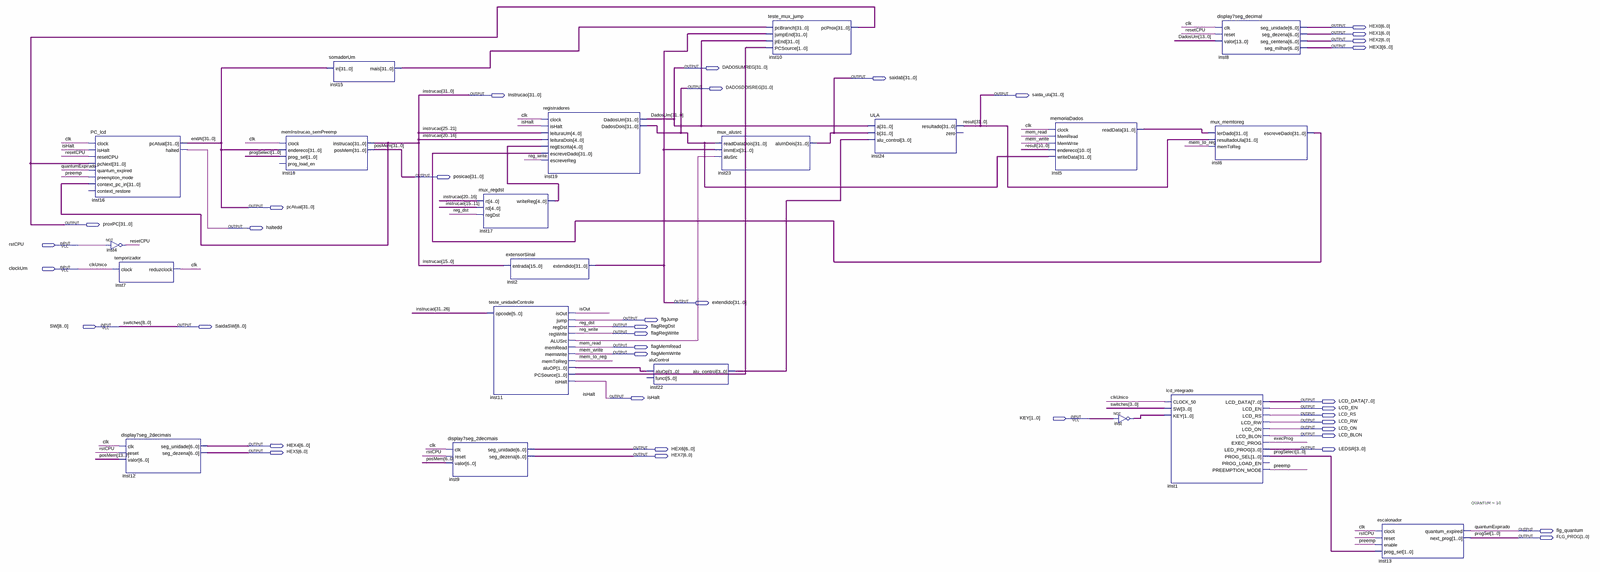
[diagram p0: schematic sheet, whole]
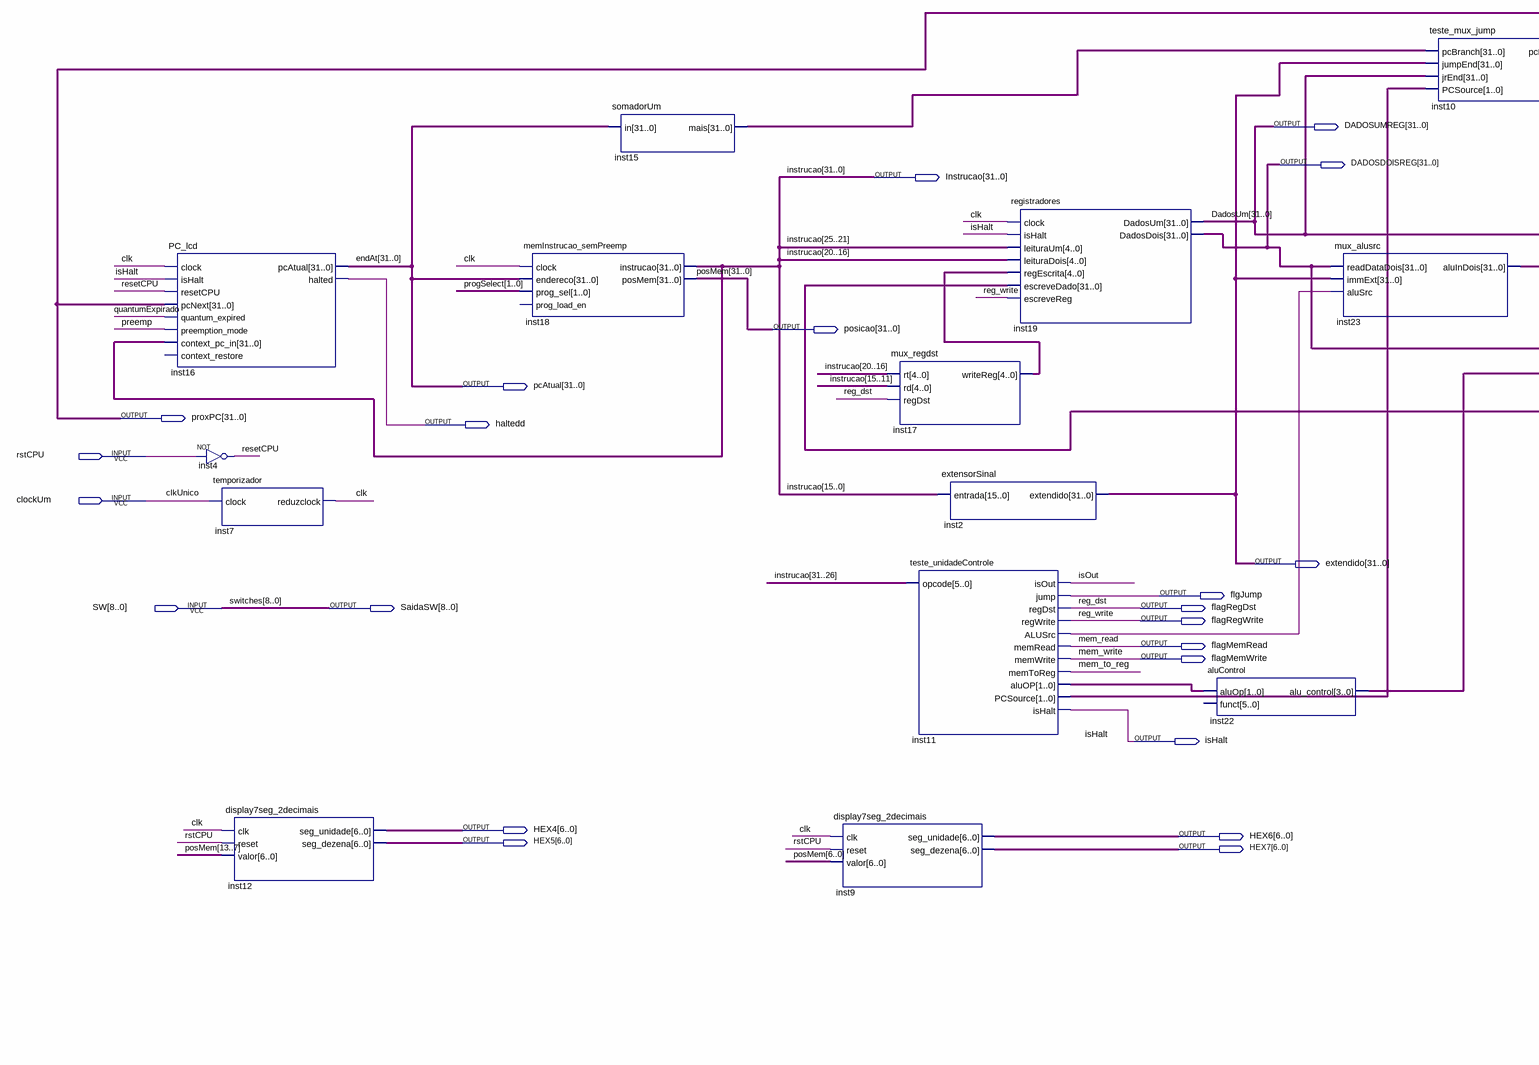
[diagram p1: schematic sheet, left part]
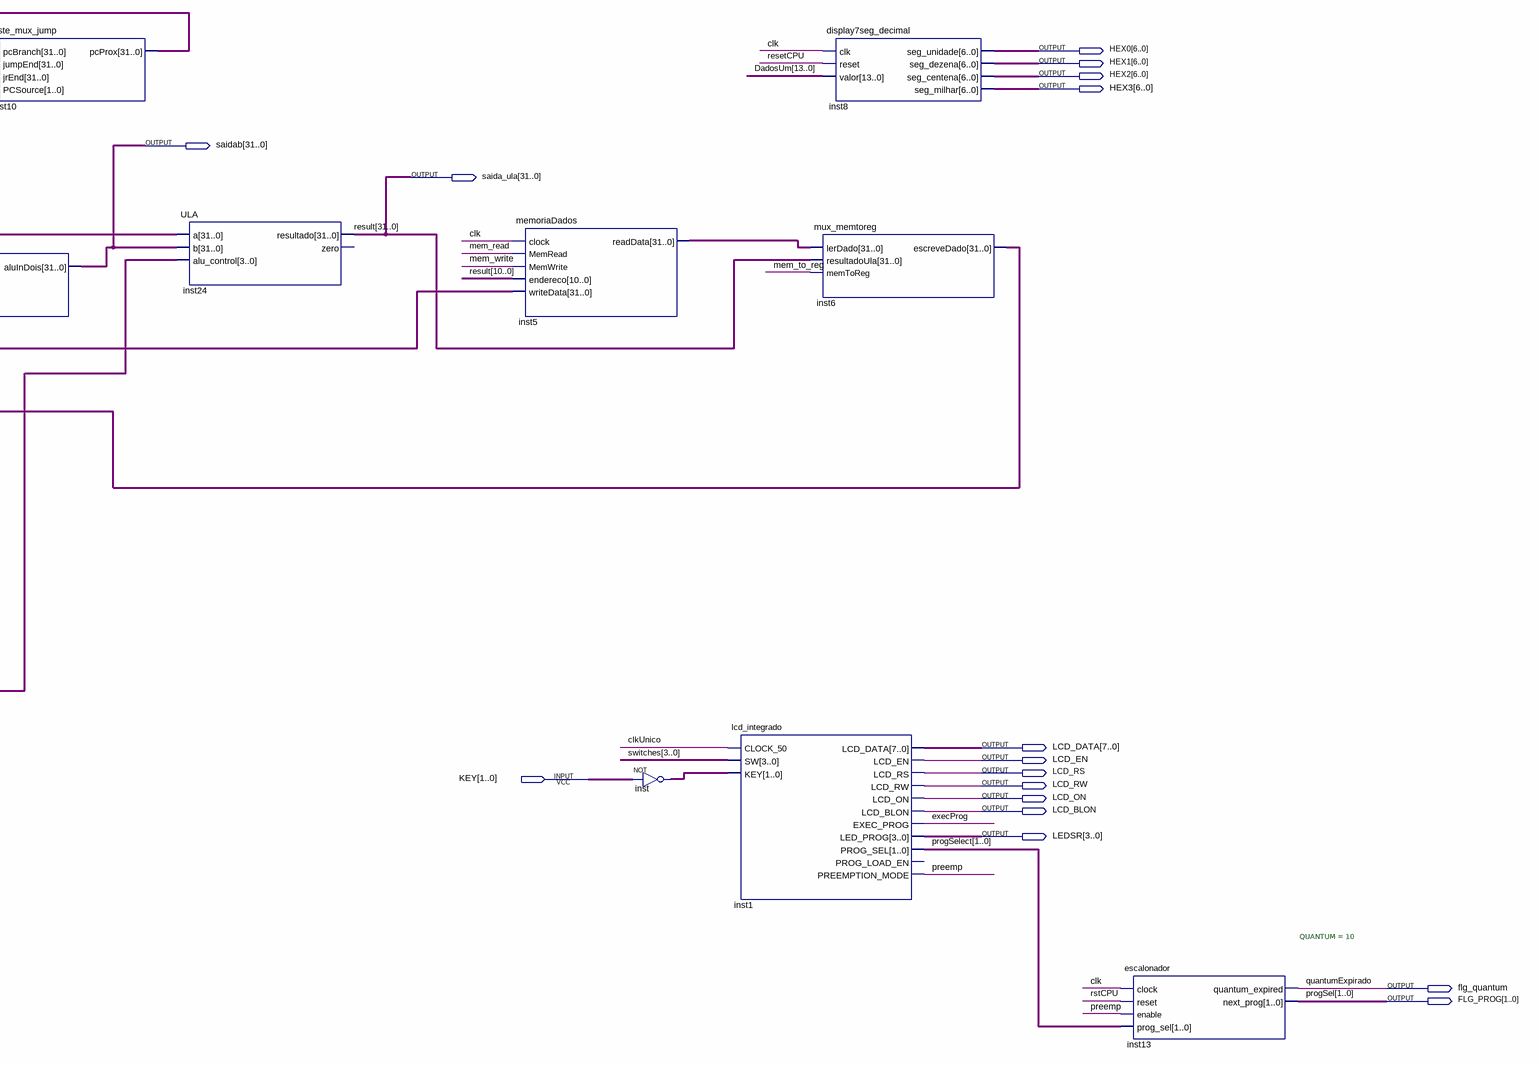
[diagram p2: schematic sheet, right part]
// Quartus schematic testeDisplay.bdf as structural Verilog: 21 symbols, 38 pins
module testeDisplay (
  input  rstCPU,
  input  clockUm,
  input  [8:0] SW,
  input  [1:0] KEY,
  output [6:0] HEX0,
  output [6:0] HEX1,
  output [6:0] HEX2,
  output [6:0] HEX3,
  output [31:0] DADOSUMREG,
  output [31:0] saidab,
  output [31:0] DADOSDOISREG,
  output [31:0] Instrucao,
  output [31:0] saida_ula,
  output [31:0] posicao,
  output [31:0] pcAtual,
  output [31:0] proxPC,
  output haltedd,
  output [31:0] extendido,
  output flgJump,
  output [8:0] SaidaSW,
  output flagRegDst,
  output flagRegWrite,
  output flagMemRead,
  output flagMemWrite,
  output isHalt,
  output [7:0] LCD_DATA,
  output LCD_EN,
  output LCD_RS,
  output LCD_RW,
  output LCD_ON,
  output LCD_BLON,
  output [6:0] HEX4,
  output [6:0] HEX6,
  output [3:0] LEDSR,
  output [6:0] HEX5,
  output [6:0] HEX7,
  output flg_quantum,
  output [1:0] FLG_PROG
);

  wire clk, execProg, inst11_alusrc, isOut, mem_to_reg, preemp, resetCPU;
  wire [1:0] inst11_aluop, inst11_pcsource, inst_out, progSelect;
  wire [3:0] inst22_alu_control;
  wire [4:0] inst17_writereg;
  wire [31:0] inst5_readdata, inst6_escrevedado, inst15_mais;

  PC_lcd inst16 (
    .clock(clk), .isHalt(isHalt), .resetCPU(resetCPU), .pcNext(proxPC), .quantum_expired(flg_quantum),
    .preemption_mode(preemp), .context_pc_in(Instrucao), .pcAtual(pcAtual), .halted(haltedd));  // open: context_restore
  not inst4 (resetCPU, rstCPU);
  temporizador inst7 (.clock(clockUm), .reduzclock(clk));
  display7seg_2decimais inst12 (
    .clk(clk), .reset(rstCPU), .valor(posicao[13:7]), .seg_unidade(HEX4), .seg_dezena(HEX5));
  memInstrucao_semPreemp inst18 (
    .clock(clk), .endereco(pcAtual), .prog_sel(progSelect), .instrucao(Instrucao), .posMem(posicao));  // open: prog_load_en
  somadorUm inst15 (.in(pcAtual), .mais(inst15_mais));
  display7seg_2decimais inst9 (.clk(clk), .reset(rstCPU), .valor(posicao[6:0]), .seg_unidade(HEX6), .seg_dezena(HEX7));
  mux_regdst inst17 (.rt(Instrucao[20:16]), .rd(Instrucao[15:11]), .regDst(flagRegDst), .writeReg(inst17_writereg));
  teste_unidadeControle inst11 (
    .opcode(Instrucao[31:26]), .isOut(isOut), .jump(flgJump), .regDst(flagRegDst), .regWrite(flagRegWrite),
    .ALUSrc(inst11_alusrc), .memRead(flagMemRead), .memWrite(flagMemWrite), .memToReg(mem_to_reg),
    .aluOP(inst11_aluop), .PCSource(inst11_pcsource), .isHalt(isHalt));
  extensorSinal inst2 (.entrada(Instrucao[15:0]), .extendido(extendido));
  registradores inst19 (
    .clock(clk), .isHalt(isHalt), .leituraUm(Instrucao[25:21]), .leituraDois(Instrucao[20:16]),
    .regEscrita(inst17_writereg), .escreveDado(inst6_escrevedado), .escreveReg(flagRegWrite),
    .DadosUm(DADOSUMREG), .DadosDois(DADOSDOISREG));
  aluControl inst22 (.aluOp(inst11_aluop), .alu_control(inst22_alu_control));  // open: funct
  mux_alusrc inst23 (.readDataDois(DADOSDOISREG), .immExt(extendido), .aluSrc(inst11_alusrc), .aluInDois(saidab));
  teste_mux_jump inst10 (
    .pcBranch(inst15_mais), .jumpEnd(extendido), .jrEnd(DADOSUMREG), .PCSource(inst11_pcsource),
    .pcProx(proxPC));
  ULA inst24 (.a(DADOSUMREG), .b(saidab), .alu_control(inst22_alu_control), .resultado(saida_ula));  // open: zero
  memoriaDados inst5 (
    .clock(clk), .MemRead(flagMemRead), .MemWrite(flagMemWrite), .endereco(saida_ula[10:0]),
    .writeData(DADOSDOISREG), .readData(inst5_readdata));
  assign inst_out = ~KEY;  // NOT inst, 2 bits wide
  lcd_integrado inst1 (
    .CLOCK_50(clockUm), .SW(SW[3:0]), .KEY(inst_out), .LCD_DATA(LCD_DATA), .LCD_EN(LCD_EN), .LCD_RS(LCD_RS),
    .LCD_RW(LCD_RW), .LCD_ON(LCD_ON), .LCD_BLON(LCD_BLON), .EXEC_PROG(execProg), .LED_PROG(LEDSR),
    .PROG_SEL(progSelect), .PREEMPTION_MODE(preemp));  // open: PROG_LOAD_EN
  display7seg_decimal inst8 (
    .clk(clk), .reset(resetCPU), .valor(DADOSUMREG[13:0]), .seg_unidade(HEX0), .seg_dezena(HEX1),
    .seg_centena(HEX2), .seg_milhar(HEX3));
  mux_memtoreg inst6 (
    .lerDado(inst5_readdata), .resultadoUla(saida_ula), .memToReg(mem_to_reg), .escreveDado(inst6_escrevedado));
  escalonador #(.QUANTUM(10)) inst13 (
    .clock(clk), .reset(rstCPU), .enable(preemp), .prog_sel(progSelect), .quantum_expired(flg_quantum),
    .next_prog(FLG_PROG));

  assign SaidaSW = SW;

  // Other names for the same wires on the sheet: clkUnico = clockUm; DadosUm[31:0] = DADOSUMREG;
  //   endAt[31:0] = pcAtual; mem_read = flagMemRead; mem_write = flagMemWrite; posMem[31:0] = posicao;
  //   progSel[1:0] = FLG_PROG; quantumExpirado = flg_quantum; reg_dst = flagRegDst; reg_write = flagRegWrite;
  //   result[31:0] = saida_ula; switches[8:0] = SW
endmodule
